# Altium schematic sheet SCH - LED Array.SchDoc
size A4; CompanyName: James Cook University; DrawnBy1: Jacob Finger; Organization: James Cook University; Title1: AS1 SCH - LED Array; Revision: 1.2; SheetNumber: 3; SheetTotal: 3; Title2: ARGB LED Array & Power Diode; DrawnBy2: Liam McLaren; ProjectName: *ProjectName
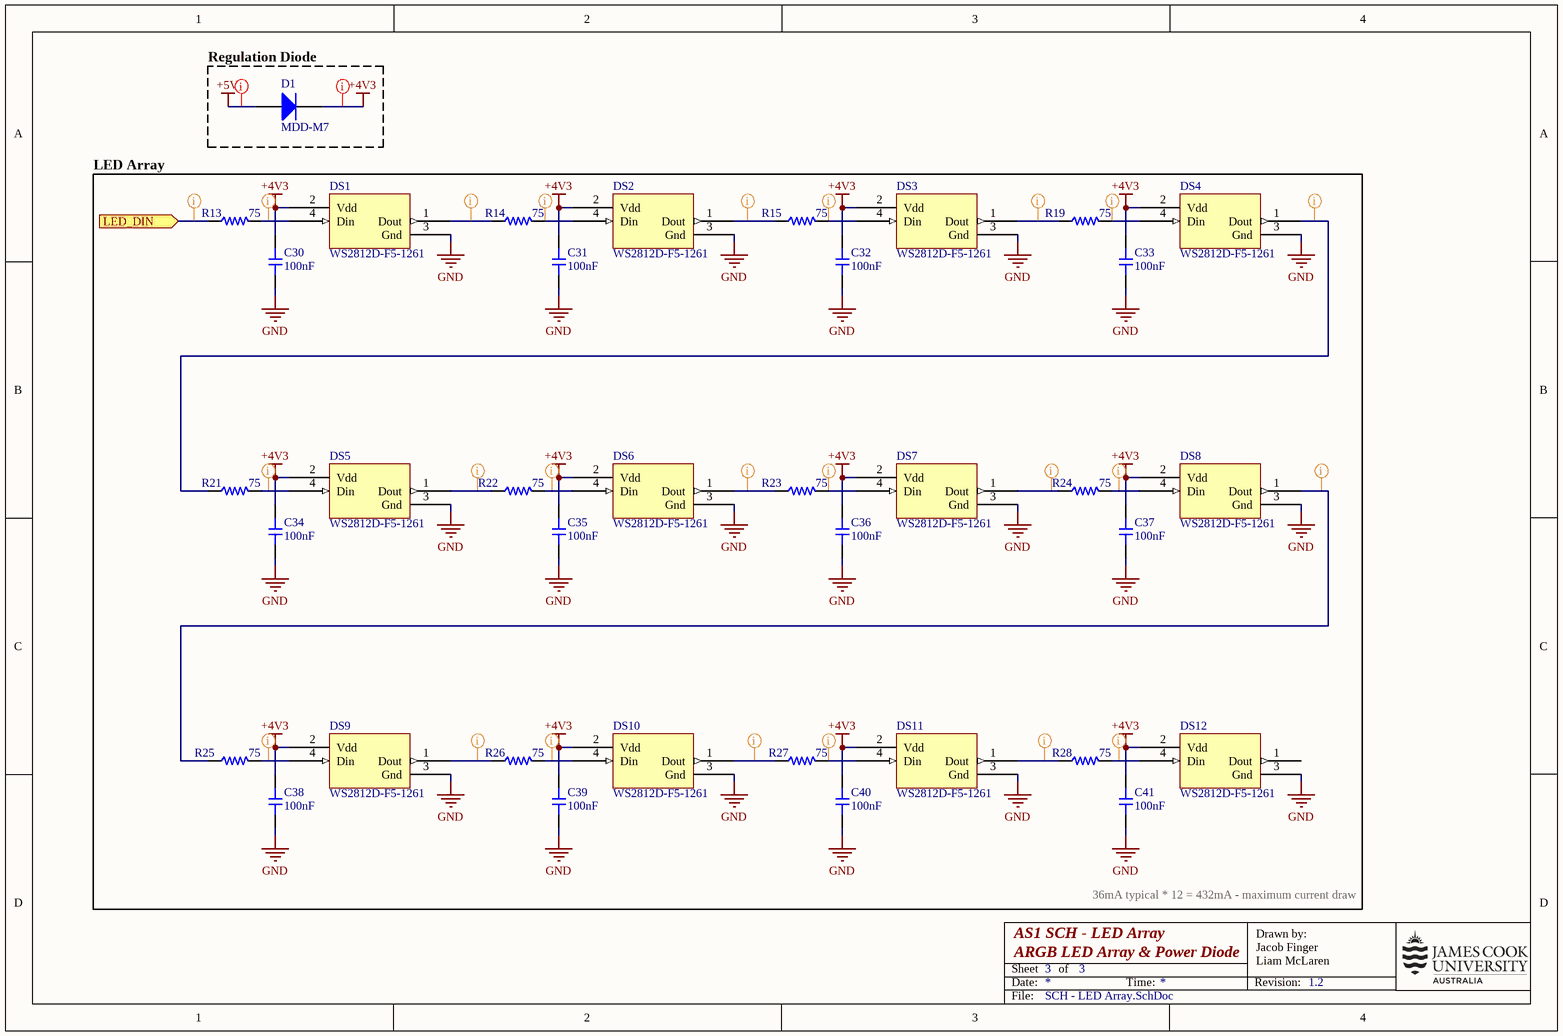
[diagram p0: SCH - LED Array.SchDoc]

## Parts
C30  value 100nF  [CAP-0402]  (hidden comment: CL05B104KO5NNNC)
C31  value 100nF  [CAP-0402]  (hidden comment: CL05B104KO5NNNC)
C32  value 100nF  [CAP-0402]  (hidden comment: CL05B104KO5NNNC)
C33  value 100nF  [CAP-0402]  (hidden comment: CL05B104KO5NNNC)
C34  value 100nF  [CAP-0402]  (hidden comment: CL05B104KO5NNNC)
C35  value 100nF  [CAP-0402]  (hidden comment: CL05B104KO5NNNC)
C36  value 100nF  [CAP-0402]  (hidden comment: CL05B104KO5NNNC)
C37  value 100nF  [CAP-0402]  (hidden comment: CL05B104KO5NNNC)
C38  value 100nF  [CAP-0402]  (hidden comment: CL05B104KO5NNNC)
C39  value 100nF  [CAP-0402]  (hidden comment: CL05B104KO5NNNC)
C40  value 100nF  [CAP-0402]  (hidden comment: CL05B104KO5NNNC)
C41  value 100nF  [CAP-0402]  (hidden comment: CL05B104KO5NNNC)
D1  MDD-M7  [DIOM4227X24M]
DS1  WS2812D-F5-1261  [WS2812D-F5-1261-Footprint-1]  (no BOM)
DS2  WS2812D-F5-1261  [WS2812D-F5-1261-Footprint-1]  (no BOM)
DS3  WS2812D-F5-1261  [WS2812D-F5-1261-Footprint-1]  (no BOM)
DS4  WS2812D-F5-1261  [WS2812D-F5-1261-Footprint-1]  (no BOM)
DS5  WS2812D-F5-1261  [WS2812D-F5-1261-Footprint-1]  (no BOM)
DS6  WS2812D-F5-1261  [WS2812D-F5-1261-Footprint-1]  (no BOM)
DS7  WS2812D-F5-1261  [WS2812D-F5-1261-Footprint-1]  (no BOM)
DS8  WS2812D-F5-1261  [WS2812D-F5-1261-Footprint-1]  (no BOM)
DS9  WS2812D-F5-1261  [WS2812D-F5-1261-Footprint-1]  (no BOM)
DS10  WS2812D-F5-1261  [WS2812D-F5-1261-Footprint-1]  (no BOM)
DS11  WS2812D-F5-1261  [WS2812D-F5-1261-Footprint-1]  (no BOM)
DS12  WS2812D-F5-1261  [WS2812D-F5-1261-Footprint-1]  (no BOM)
R13  value 75  [RES-0603]  (hidden comment: 0603WAF750JT5E)
R14  value 75  [RES-0603]  (hidden comment: 0603WAF750JT5E)
R15  value 75  [RES-0603]  (hidden comment: 0603WAF750JT5E)
R19  value 75  [RES-0603]  (hidden comment: 0603WAF750JT5E)
R21  value 75  [RES-0603]  (hidden comment: 0603WAF750JT5E)
R22  value 75  [RES-0603]  (hidden comment: 0603WAF750JT5E)
R23  value 75  [RES-0603]  (hidden comment: 0603WAF750JT5E)
R24  value 75  [RES-0603]  (hidden comment: 0603WAF750JT5E)
R25  value 75  [RES-0603]  (hidden comment: 0603WAF750JT5E)
R26  value 75  [RES-0603]  (hidden comment: 0603WAF750JT5E)
R27  value 75  [RES-0603]  (hidden comment: 0603WAF750JT5E)
R28  value 75  [RES-0603]  (hidden comment: 0603WAF750JT5E)

## Blocks framed on the sheet
Regulation Diode: D1
LED Array: C30-C41 DS1-DS12 R13-R15 R19 R21-R28

## Ports
LED_DIN (in, see SCH - Inputs and Intermediary[2D])

## Nets
+4V3: C30.2 C31.2 C32.2 C33.2 C34.2 C35.2 C36.2 C37.2 C38.2 C39.2 C40.2 C41.2 D1.1 DS1.2(Vdd) DS2.2(Vdd) DS3.2(Vdd) DS4.2(Vdd) DS5.2(Vdd) DS6.2(Vdd) DS7.2(Vdd) DS8.2(Vdd) DS9.2(Vdd) DS10.2(Vdd) DS11.2(Vdd) DS12.2(Vdd)
+5V: D1.2
GND: C30.1 C31.1 C32.1 C33.1 C34.1 C35.1 C36.1 C37.1 C38.1 C39.1 C40.1 C41.1 DS1.3(Gnd) DS2.3(Gnd) DS3.3(Gnd) DS4.3(Gnd) DS5.3(Gnd) DS6.3(Gnd) DS7.3(Gnd) DS8.3(Gnd) DS9.3(Gnd) DS10.3(Gnd) DS11.3(Gnd) DS12.3(Gnd)
LED_DIN: R13.1 ; port LED_DIN
NetDS1_1: DS1.1(Dout) R14.1
NetDS1_4: DS1.4(Din) R13.2
NetDS2_1: DS2.1(Dout) R15.1
NetDS2_4: DS2.4(Din) R14.2
NetDS3_1: DS3.1(Dout) R19.1
NetDS3_4: DS3.4(Din) R15.2
NetDS4_1: DS4.1(Dout) R21.1
NetDS4_4: DS4.4(Din) R19.2
NetDS5_1: DS5.1(Dout) R22.1
NetDS5_4: DS5.4(Din) R21.2
NetDS6_1: DS6.1(Dout) R23.1
NetDS6_4: DS6.4(Din) R22.2
NetDS7_1: DS7.1(Dout) R24.1
NetDS7_4: DS7.4(Din) R23.2
NetDS8_1: DS8.1(Dout) R25.1
NetDS8_4: DS8.4(Din) R24.2
NetDS9_1: DS9.1(Dout) R26.1
NetDS9_4: DS9.4(Din) R25.2
NetDS10_1: DS10.1(Dout) R27.1
NetDS10_4: DS10.4(Din) R26.2
NetDS11_1: DS11.1(Dout) R28.1
NetDS11_4: DS11.4(Din) R27.2
NetDS12_4: DS12.4(Din) R28.2

Not connected (* = marked no-connect by the designer): DS12 1(Dout)

## Layout directives
net class Power: +4V3, +5V
net class Signals: LED_DIN, NetDS1_1, NetDS1_4, NetDS2_1, NetDS2_4, NetDS3_1, NetDS3_4, NetDS4_1, NetDS4_4, NetDS5_1, NetDS5_4, NetDS6_1, NetDS6_4, NetDS7_1, NetDS7_4, NetDS8_1, NetDS8_4, NetDS9_1, NetDS9_4, NetDS10_1, NetDS10_4, NetDS11_1, NetDS11_4, NetDS12_4

## Notes on the sheet
- 36mA typical * 12 = 432mA - maximum current draw
- Date:
- Sheet
- of
- Time:
- Revision:
- Drawn by:
- File:

## Library data of the parts
C30-C41 = CMP-001-00147-3: Capacitor, Ceramic (MLCC), 100nF, ±10%, 16V, X7R, ±10%, SMD 0402; Manufacturer: Samsung Electro-Mechanics; Manufacturer Part Number: CL05B104KO5NNNC; ComponentLink1Description: Datasheet; RoHS: Yes; Voltage Rating: 16V; ComponentLink2URL: https://jlcpcb.com/partdetail/C1525; Temperature Coefficient: X7R; ComponentLink2Description: JLCPCB Part URL; JLCPCB Part Number: C1525; ComponentLink3URL: https://lcsc.com/product-detail/Multilayer-Ceramic-Capacitors-MLCC---SMD-SMT_Samsung-Electro-Mechanics-Samsung-Electro-Mechanics-CL05B104KO5NNNC_C1525.html; ComponentLink3Description: LCSC Part URL; Source: jlcpcb_capacitors_basic.schlib; Design Item ID: CL05B104KO5NNNC; Category: Capacitors - MLCC; ComponentLink1URL: https://datasheet.lcsc.com/lcsc/1810191219_Samsung-Electro-Mechanics-CL05B104KO5NNNC_C1525.pdf; JLCPCB Basic Part: Yes; Tolerance: 10%; Case/Package: 0402
D1 = CMP-007-0005-1: General purpose rectifier, 1.0 A, 1 kV, DO-214AC SMD; Manufacturer Part Number: M7; Manufacturer: MDD (Microdiode Electronics); Maximum DC blocking voltage: 1000 V; Maximum forward rectified current: 1.0 A; JLCPCB Part: C95872
DS1-DS12 = CMP-010-0002-2: Through-hole addressable RGB LED, 5mm
R13-R15 R19 R21-R28 = CMP-009-00347-2: Resistor, 75Ω, ±1%, 100mW, 75V, ±200ppm/℃, -55℃~+155℃, SMD 0603; Manufacturer: Uniroyal; Temperature Rating: -55℃~+155℃; Manufacturer Part Number: 0603WAF750JT5E; Tolerance: 1%; JLCPCB Basic Part: Yes; ComponentLink2Description: JLCPCB Part URL; Power Rating: 100mW; ComponentLink1Description: Datasheet; Category: Resistors; JLCPCB Part Number: C4275; Source: jlcpcb_resistors_basic.schlib; Voltage Rating: 75V; ComponentLink2URL: https://jlcpcb.com/partdetail/C4275; ComponentLink1URL: https://datasheet.lcsc.com/lcsc/2206010216_UNI-ROYAL-Uniroyal-Elec-0603WAF750JT5E_C4275.pdf; Case/Package: 0603; Temperature Coefficient: ±200ppm/℃; Design Item ID: 0603WAF750JT5E